# Altium schematic sheet Sheet1.SchDoc
size A; SheetNumber: 1; SheetTotal: 1
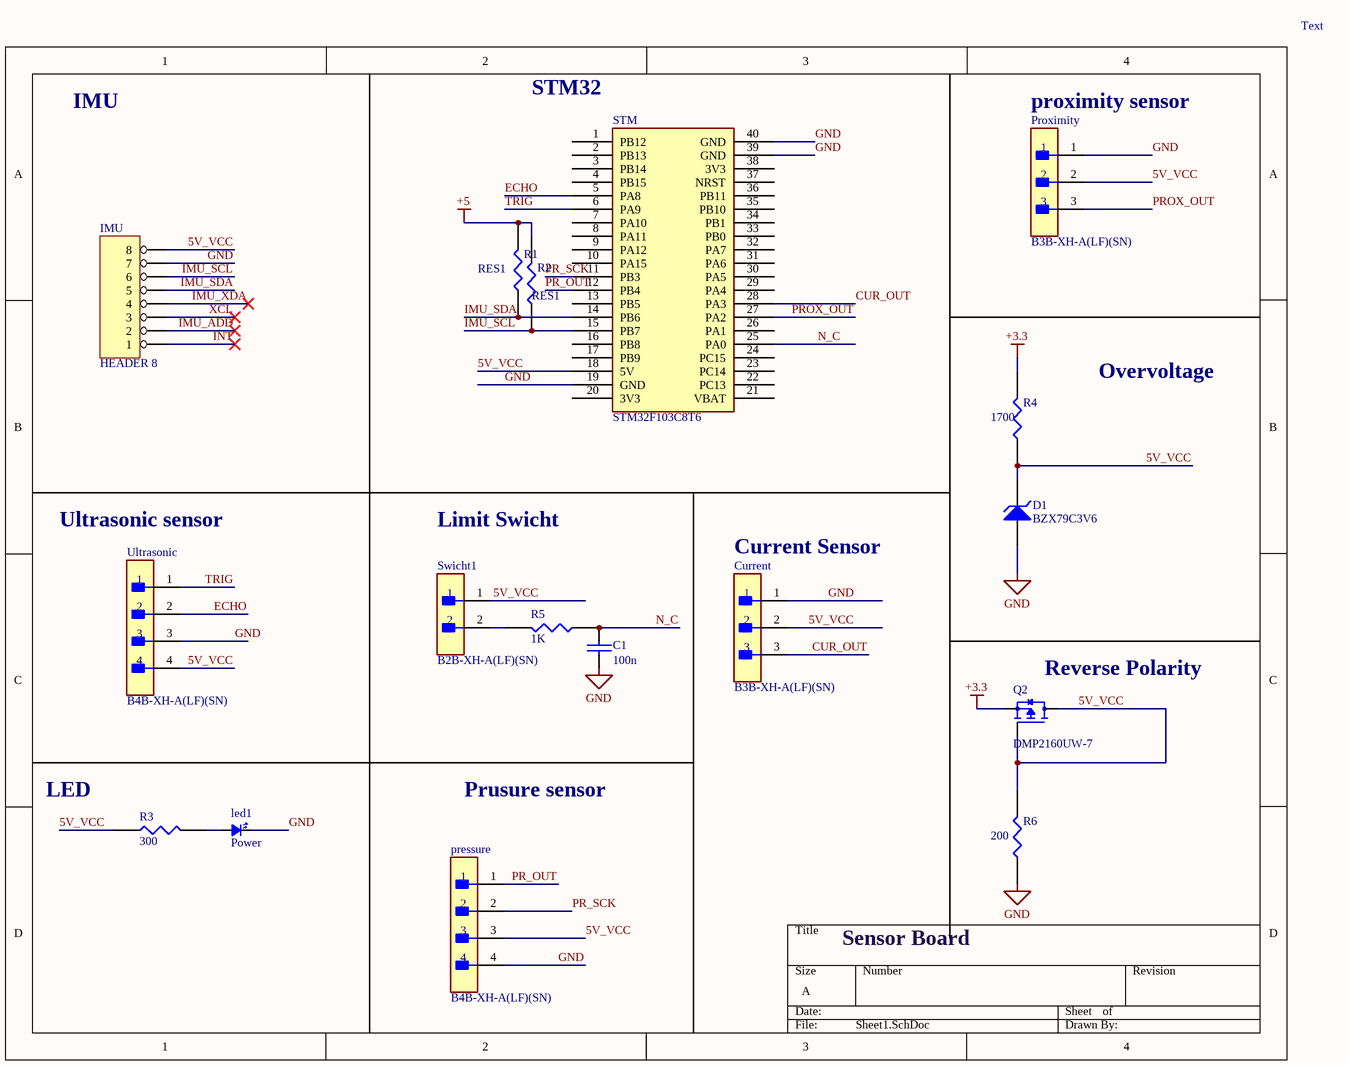
[diagram p0: Sheet1.SchDoc]

## Parts
C1  100n  [RAD0.1]
Current  B3B-XH-A(LF)(SN)  [FP-B3B-XH-A_LF_SN-MFG]
D1  BZX79C3V6  [FAIR-DO-35-2]
IMU  HEADER 8  [SIP8]
led1  Power  [LED-05 R]
pressure  B4B-XH-A(LF)(SN)  [FP-B4B-XH-A_LF_SN-MFG]
Proximity  B3B-XH-A(LF)(SN)  [FP-B3B-XH-A_LF_SN-MFG]
Q2  DMP2160UW-7  [TRANS_DMP2160UW-7]
R1  RES1  [AXIAL0.3]
R2  RES1  [AXIAL0.3]
R3  300  [AXIAL0.3]
R4  1700  [AXIAL0.3]
R5  1K  [AXIAL0.3]
R6  200  [AXIAL0.3]
STM  STM32F103C8T6  [Stm32 BluePill]
Swicht1  B2B-XH-A(LF)(SN)  [FP-B2B-XH-A_LF_SN-MFG]
Ultrasonic  B4B-XH-A(LF)(SN)  [FP-B4B-XH-A_LF_SN-MFG]

## Nets
+3.3: Q2.2(S) R4.2
+5: R1.2 R2.2
GND: C1.2 Current.1 D1.1(A) IMU.7 led1.2 pressure.4 Proximity.1 R6.1 STM.19(GND) STM.39(GND) STM.40(GND) Ultrasonic.3
5V_VCC: Current.2 D1.2(K) IMU.8 pressure.3 Proximity.2 Q2.1(G) Q2.3(D) R3.1 R4.1 R6.2 STM.18(5V) Swicht1.1 Ultrasonic.4
CUR_OUT: Current.3 STM.28(PA3)
ECHO: STM.5(PA8) Ultrasonic.2
IMU_ADD: IMU.2
IMU_SCL: IMU.6 R2.1 STM.15(PB7)
IMU_SDA: IMU.5 R1.1 STM.14(PB6)
IMU_XDA: IMU.4
INT: IMU.1
N_C: C1.1 R5.1 STM.25(PA0)
PR_OUT: pressure.1 STM.12(PB4)
PR_SCK: pressure.2 STM.11(PB3)
PROX_OUT: Proximity.3 STM.27(PA2)
TRIG: STM.6(PA9) Ultrasonic.1
XCL: IMU.3
Netled1_1: led1.1 R3.2
NetR5_2: R5.2 Swicht1.2

Not connected (* = marked no-connect by the designer): STM 1(PB12) 2(PB13) 3(PB14) 4(PB15) 7(PA10) 8(PA11) 9(PA12) 10(PA15) 13(PB5) 16(PB8) 17(PB9) 20(3V3) 21(VBAT) 22(PC13) 23(PC14) 24(PC15) 26(PA1) 29(PA4) 30(PA5) 31(PA6) 32(PA7) 33(PB0) 34(PB1) 35(PB10) 36(PB11) 37(NRST) 38(3V3)

## Notes on the sheet
- Text
- IMU
- (near STM) STM32
- (near Proximity) proximity sensor
- Overvoltage
- Ultrasonic sensor
- Limit Swicht
- (near Current) Current Sensor
- (near Q2) Reverse Polarity
- LED
- Prusure sensor
- Sensor Board

## Library data of the parts
C1 = CAP: Capacitor
Current Proximity = CMP-17439-000014-3: CONN HEADER VERT 3POS 2.5MM; Max Voltage Rating (DC): 250V; Number of Positions: 3; Current Rating: 3A; Gender: Male; Wire/Cable Gauge: 22AWG; Contact Resistance: 20mR; Insulation Resistance: 1GR; Insulation Material: Nylon; Contact Plating: Tin; Depth: 5.75mm; Contact Type: Male Pin; Max Operating Temperature: 85°C; Insulation Color: Natural; Voltage Rating (AC): 250V; Color: Natural; Connector Type: Header; Orientation: Straight; Fastening Type: Detent; Housing Color: White; Min Operating Temperature: -25°C; Termination: Solder; Voltage Rating: 250V; Series: XH; Pitch: 2.5mm; Contact Shape: Square; Number of Rows: 1; Lead Free: Lead Free; Packaging: Bulk; Mount: Through Hole; Flammability Rating: UL94 V-0; Max Voltage Rating (AC): 250V; REACH SVHC: No SVHC; Housing Material: Polyamide; Contact Material: Brass; Lead Pitch: 2.5mm; Contact Finish - Mating: TIN; Length: 9.9mm; Max Current Rating: 3A; Number of Contacts: 3
D1 = CMP-004-00021-2: Zener Diode, 3.6 V, 5 mA, -65 to 200 degC, 2-Pin DO-35, RoHS, Bulk; Manufacturer: Fairchild Semiconductor; Tolerance: 6%; Power: 500mW; Forward Voltage: 1.5V; Impedance: 90Ohm; Package Quantity: 1000; Min Operating Temperature: -65°C; Datasheet Version: Rev. C1, 07/2007; Max Operating Temperature: 200°C; Mounting Technology: TH; Package Description: 2-Pin Through Hole Diode, Dia 1.72 mm, Body Length 3.805 mm; RoHS Compliant: True; Manufacturer URL: https://www.fairchildsemi.com/; Package Reference: DO-35-2; Case/Package: DO-35-2; Datasheet URL: https://www.fairchildsemi.com/datasheets/BZ/BZX79C3V6.pdf; Package URL: https://www.fairchildsemi.com/package-drawings/DO/DO35A.pdf; Pins: 2; Packaging: Bulk
IMU = HEADER 8: 8 Pin Header
led1 = LED_1
pressure Ultrasonic = CMP-17439-000250-1: CONN HEADER VERT 4POS 2.5MM; Number of Contacts: 4; Contact Resistance: 20mR; Voltage Rating: 250V; Max Current Rating: 3A; Gender: Male; Wire/Cable Gauge: 22AWG; Mated Stacking Heights: 9.8mm; Insulation Resistance: 1GR; Orientation: Straight; Contact Type: Male Pin; Contact Finish - Mating: TIN; Series: XH; Max Voltage Rating (AC): 250V; Lead Pitch: 2.5mm; Contact Shape: Square; Insulation Color: Natural; Termination: Solder; Lead Free: Lead Free; Voltage Rating (AC): 250V; Number of Rows: 1; Flammability Rating: UL94 V-0; Number of Positions: 4; Max Operating Temperature: 85°C; Package Quantity: 500; Mount: Through Hole; REACH SVHC: No SVHC; Connector Type: Header; Insulation Material: Nylon; Fastening Type: Detent; Min Operating Temperature: -25°C; Housing Color: White; Packaging: Bulk; Contact Plating: Tin; Contact Material: Brass; Max Voltage Rating (DC): 250V; Housing Material: Polyamide; Color: Natural; Material: Polyamide; Pitch: 2.5mm; Depth: 5.75mm; Current Rating: 3A; Length: 12.4mm
Q2 = DMP2160UW-7: P-Channel 20 V 1.5A (Ta) 350mW (Ta) Surface Mount SOT-323; MF: Diodes Inc.; Value: *; Check_prices: https://www.snapeda.com/parts/DMP2160UW-7/Diodes+Inc./view-part/?ref=eda; Availability: In Stock; Price: None; Package: SOT-323 Diodes Inc.; Purchase-URL: https://pricing.snapeda.com/search/part/DMP2160UW-7/?ref=eda; SnapEDA_Link: https://www.snapeda.com/parts/DMP2160UW-7/Diodes+Inc./view-part/?ref=snap; MP: DMP2160UW-7
R3-R6 = RES1
STM = BluePill: Designed By @Alixahedi
Swicht1 = CMP-2000-05888-3: CONN HEADER VERT 2POS 2.5MM; Current Rating: 3A; Voltage Rating: 250V; Number of Contacts: 2; Contact Resistance: 20mR; Wire/Cable Gauge: 22AWG; Insulation Resistance: 1GR; Connector Type: Male Pin; Packaging: Bulk; Contact Material: Brass; Lead Free: Lead Free; Orientation: Straight; Contact Plating: Tin; Max Current Rating: 3A; Termination: Solder; Fastening Type: Detent; Depth: 5.75mm; Housing Material: Polyamide; REACH SVHC: No SVHC; Series: XH; Voltage Rating (AC): 250V; Number of Positions: 2; Color: Natural; Contact Type: Male Pin; Max Voltage Rating (DC): 250V; Pitch: 2.5mm; Lead Pitch: 2.5mm; Mount: Through Hole; Max Operating Temperature: 85°C; Length: 7.4mm; Max Voltage Rating (AC): 250V; Min Operating Temperature: -25°C; Number of Rows: 1; Housing Color: White